# EAGLE design dcc_sniffer_nano (EAGLE 7.7.0)
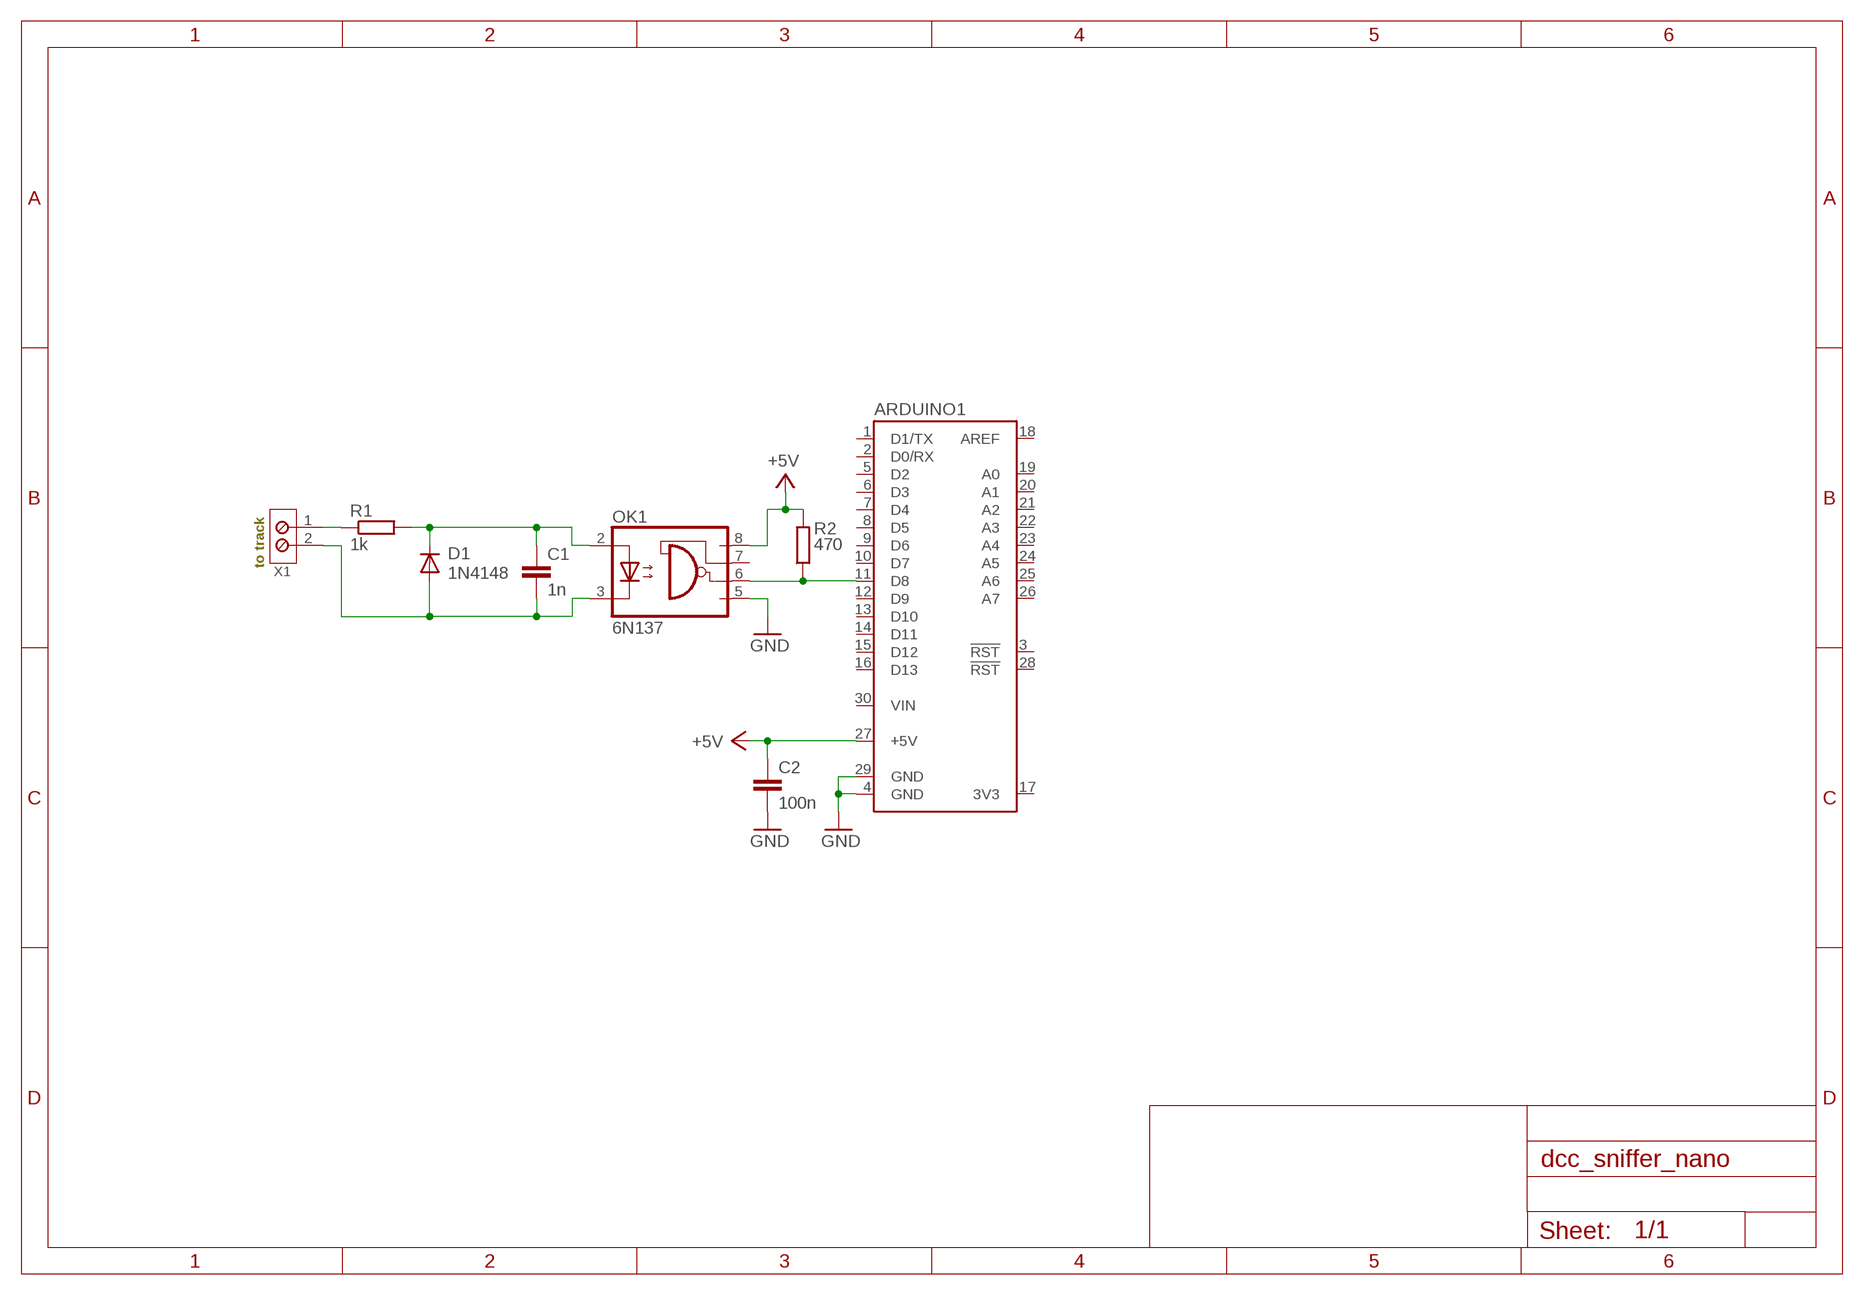
[diagram p0: schematic, sheet 1]

## Parts
ARDUINO1  ARDUINO_NANO  [ARDUINO_NANO]
C1  1n  C-EU025-025X050  [C025-025X050]
C2  100n  C-EU025-025X050  [C025-025X050]
D1  1N4148  [DO35_L10M0]
OK1  6N137  [DIL08]
R1  1k  R-EU_0207/10  [0207/10]
R2  470  R-EU_0207/10  [0207/10]
X1  RT034 Typ 086  SCWTRMX02-3M81  [RT03402T086]

## Nets
+5V: ARDUINO1.27(+5V) C2.1 OK1.8(VCC) R2.2
GND: ARDUINO1.4(GND) ARDUINO1.29(GND) C2.2 OK1.5(GND)
N$1: C1.1 D1.C OK1.2(A) R1.2
N$2: C1.2 D1.A OK1.3(C) X1.2
N$3: ARDUINO1.11(D8) OK1.6(VO) R2.1
N$4: R1.1 X1.1
Unconnected: ARDUINO1.1(D1/TX) ARDUINO1.2(D0/RX) ARDUINO1.3(!RST) ARDUINO1.5(D2) ARDUINO1.6(D3) ARDUINO1.7(D4) ARDUINO1.8(D5) ARDUINO1.9(D6) ARDUINO1.10(D7) ARDUINO1.12(D9) ARDUINO1.13(D10) ARDUINO1.14(D11) ARDUINO1.15(D12) ARDUINO1.16(D13) ARDUINO1.17(3V3) ARDUINO1.18(AREF) ARDUINO1.19(A0) ARDUINO1.20(A1) ARDUINO1.21(A2) ARDUINO1.22(A3) ARDUINO1.23(A4) ARDUINO1.24(A5) ARDUINO1.25(A6) ARDUINO1.26(A7) ARDUINO1.28(!RST) OK1.7(VE)

## Notes on the sheet
- to track

## Power pins joined to a net without a drawn wire
VIN: ARDUINO1.30(VIN)

## Library data of the parts
ARDUINO1 = omcArduino:ARDUINO_NANO: Arduino Nano Footprint
C1 C2 = resistor:C-EU: CAPACITOR, European symbol
D1 = omcDiode:1N4148: 1N4148 - Fast Switching PN Diode Silicon Epitaxial Planar Diodes Temperature: -65°C to +175°C 1N4148 100V/0.15A DO35 Package Fairchild Datasheet <https://www.fairchildsemi.com/datasheets/1N/1N914.pdf> Reichelt Datasheet <http://cdn-reichelt.de/documents/datenblatt/A400/1N4148_1N4448_1N914_FAI.pdf> 1N4148WS 75V/0.15A SOD323 Package Semtech Datasheet <http://www.semtech.net.cn/script/product/manage/pic/7301654109639.pdf> Reichelt Datasheet <http://cdn-reichelt.de/documents/datenblatt/A400/1N4148WS.pdf> LL4148 100V/0.15A SOD80/MiniMELF Package Vishay Datasheet <http://www.diodes.com/_files/datasheets/ds30044.pdf> Reichelt Datasheet <http://cdn-reichelt.de/documents/datenblatt/A100/SMD1N4148%23VIS.pdf>; DIST#REICHELT#: 1N 4148; VENDOR#: FAIRCHILD,1N4148
OK1 = optocoupler:6N137: MOTOROLA OPTO COUPLER; MPN: 6N137; OC_FARNELL: 1328376; OC_NEWARK: 52M1895
R1 R2 = resistor:R-EU_: RESISTOR, European symbol
X1 = omcConnector:SCWTRMX02: Screw solder terminal - X02 pole: 2 srew terminal, plugable rectangular cable connection, 90° stackable without lost of contact RT034 - Typ 086 - 3.81mm grid: Metz Connect Productside <http://www.metz-connect.com/de/products/310861> Metz Connect Datasheet <http://www.metz-connect.com/de/system/files/productfiles/Datenblatt_310861_RT034xxHBLC_OFF-026114I.pdf> Reichelt Datasheet <http://cdn-reichelt.de/documents/datenblatt/C151/AKL086.pdf> RT035 - Typ 094 - 5mm grid: Metz Connect Productside <http://www.metz-connect.com/de/products/310941> Metz Connect Datasheet <http://www.metz-connect.com/de/system/files/productfiles/Datenblatt_310941_RT035xxHBLU_OFF-022741Q.pdf> Metz connect terminal - electrical and mechanical parameter Parameter RT034 - Typ 086 (3.81mm grid) RT035 - Typ 094 (5mm grid) conductor diameter (single wire) 0,2 - 1,5 mm² (AWG 28 - 16) 0,2 - 1,5 mm² (AWG 26 - 16) conductor diameter (multi wire) 0,2 - 1,5 mm² (AWG 28 - 16) 0,2 - 1,5 mm² (AWG 26 - 16) smallest leackage path 2 mm 3,2 mm IEC 60529 IP 00 IP 20 strip length (min) 5mm 6 mm Distributor Reichelt: avialable Conrad: avialable Digi-Key: -; DIST#REICHELT#: AKL 086-02; VENDOR#: Metz Connect#31086102

## Board
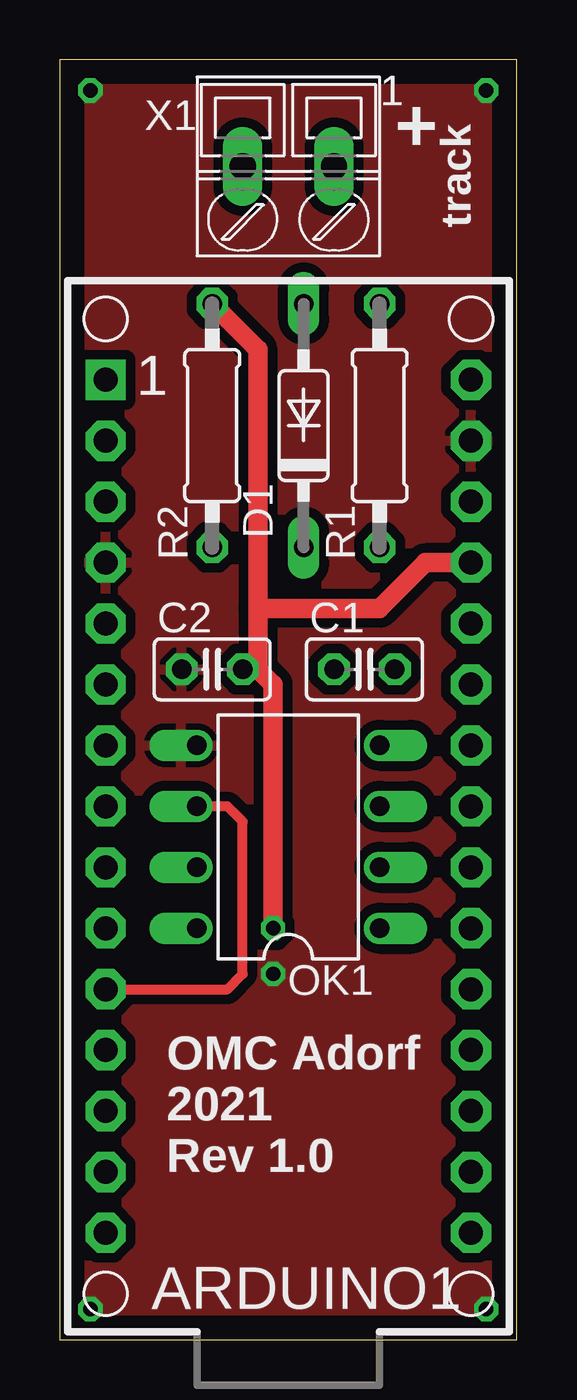
[diagram p1: board, top side]
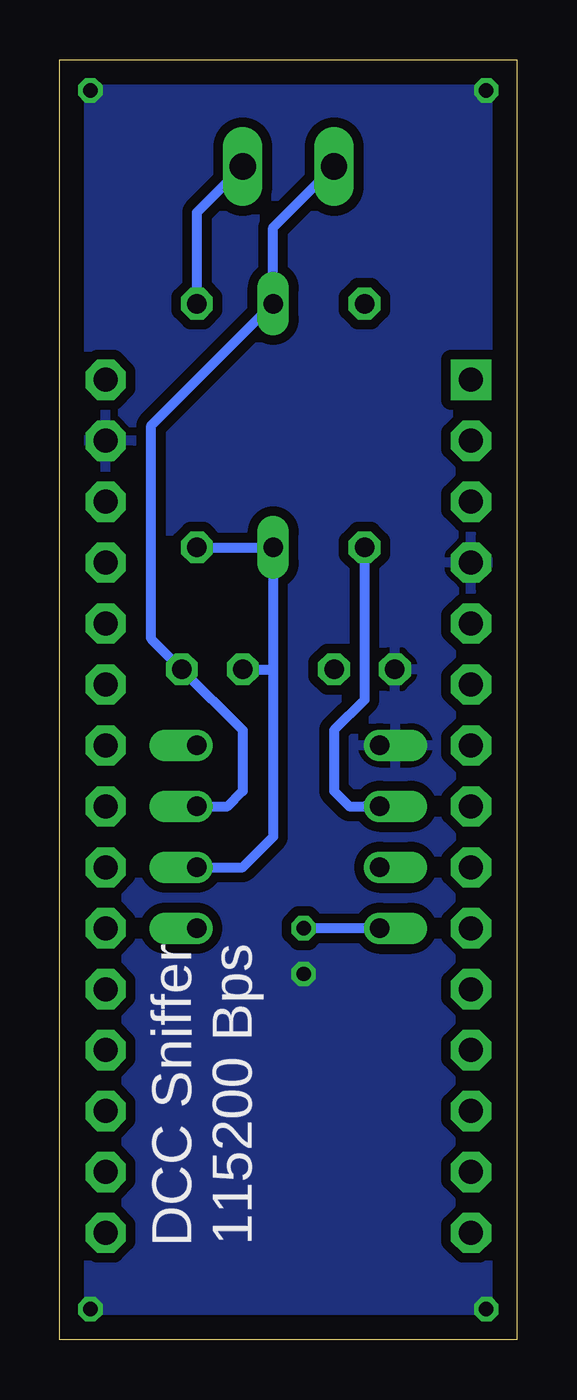
[diagram p2: board, bottom side, seen from below]

Size 19.05 x 53.34 mm. Coordinates in mm from the lower left corner, seen from the top.
Outline: 0,0 19.05,0 19.05,53.34 0,53.34 0,0
Copper layers (1*16): Top 0.035mm / dielectric 1.5mm / Bottom 0.035mm
Design rules "default": minimum track width 10mil, minimum drill 24mil, track to track 8mil, track to pad 8mil, pad to pad 8mil, via to via 8mil, smd to smd 8mil, copper to edge 40mil, drill to drill 8mil, minimum pad ring 10mil, minimum via ring 8mil, stop-mask expansion 4mil, vias tented up to drill 0mil, thermal gap 10mil

### Footprints (pad centres in the part's own frame; a part is rotated, then mirrored left to right if it is on the bottom)
ARDUINO_NANO = drill 1 pad 1.676 square: 1 -7.62,17.78 | drill 1 pad 1.676 octagon: 2 -7.62,15.24; 3 -7.62,12.7; 4 -7.62,10.16; 5 -7.62,7.62; 6 -7.62,5.08; 7 -7.62,2.54; 8 -7.62,0; 9 -7.62,-2.54; 10 -7.62,-5.08; 11 -7.62,-7.62; 12 -7.62,-10.16; 13 -7.62,-12.7; 14 -7.62,-15.24; 15 -7.62,-17.78; 16 7.62,-17.78; 17 7.62,-15.24; 18 7.62,-12.7; 19 7.62,-10.16; 20 7.62,-7.62; 21 7.62,-5.08; 22 7.62,-2.54; 23 7.62,0; 24 7.62,2.54; 25 7.62,5.08; 26 7.62,7.62; 27 7.62,10.16; 28 7.62,12.7; 29 7.62,15.24; 30 7.62,17.78
C025-025X050 = drill 0.813 octagon: 1 -1.27,0; 2 1.27,0
DO35_L10M0 = drill 0.813 long: A 3.81,0; C -6.35,0
DIL08 = drill 0.813 offset: 1 -3.81,-3.81; 2 -1.27,-3.81; 3 1.27,-3.81; 4 3.81,-3.81; 5 3.81,3.81; 6 1.27,3.81; 7 -1.27,3.81; 8 -3.81,3.81
0207/10 = drill 0.813 octagon: 1 -5.08,0; 2 5.08,0
RT03402T086 = drill 1.1 long: 1 0,0; 2 3.81,0

### Placement (x,y rotation side)
ARDUINO1  9.53,22.23 0 top
C1  12.7,27.94 0 top
C2  6.35,27.94 180 top
D1  10.16,39.37 90 top
OK1  9.53,20.95 90 top
R1  13.34,38.1 270 top
R2  6.35,38.1 90 top
X1  11.43,48.9 180 top

### Tracks (layer width: path | path; a pad name or v marks a point on that pad's centre or on a via)
+5V  (via drill 0.6)
  Top 0.406: C2.1 8.26,27.94
  Top 0.813: ARDUINO1.27 15.24,32.38 13.34,30.48 8.26,30.48 | R2.2 8.26,41.27 8.26,30.48 | 8.26,30.48 8.26,27.94 8.89,27.3 v8.89,17.14
  Bottom 0.406: OK1.8 v8.89,17.14
GND  (via drill 0.6 pad 0.81)
  other vias: 1.27,52.07 17.78,52.07 1.27,1.27 17.78,1.27 8.89,15.24
  pour Bottom (isolate 0.406): 0,53.34 0,0 19.05,0 19.05,53.34
  pour Top (isolate 0.406): 0,53.34 0,0 19.05,0 19.05,53.34
N$1
  Bottom 0.406: OK1.2 11.43,19.68 10.16,20.95 10.16,27.94 | 10.16,27.94 D1.C R1.2 | C1.1 10.16,27.94
N$2
  Bottom 0.406: X1.2 10.16,46.35 D1.A 15.24,38.1 15.24,29.21 C1.2 11.43,25.4 11.43,22.86 12.06,22.23 OK1.3
N$3
  Top 0.406: ARDUINO1.11 6.99,14.61 7.62,15.24 7.62,21.59 6.99,22.23 OK1.6
  Bottom 0.406: 6.35,22.23 OK1.6 6.99,22.23 7.62,22.86 7.62,25.4 6.35,26.67 R2.1
N$4
  Bottom 0.406: R1.1 13.34,46.99 X1.1

### Text on the board
tPlace: + | track | OMC Adorf / 2021 / Rev 1.0
bNames: DCC Sniffer / 115200 Bps